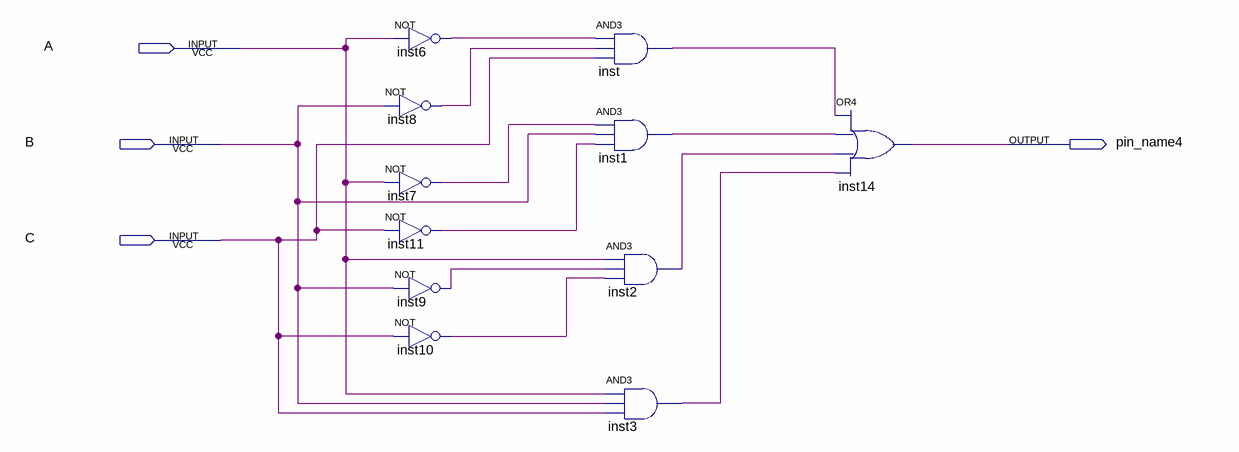
[diagram p0: schematic sheet]
// Quartus schematic Task1A.bdf as structural Verilog: 11 symbols, 4 pins
module Task1A (
  input  A,
  input  B,
  input  C,
  output pin_name4
);

  wire inst1_out, inst2_out, inst3_out, inst6_out, inst7_out, inst8_out, inst9_out, inst10_out, inst11_out,
       inst_out;

  not inst6 (inst6_out, A);
  not inst8 (inst8_out, B);
  not inst7 (inst7_out, A);
  not inst11 (inst11_out, C);
  not inst9 (inst9_out, B);
  not inst10 (inst10_out, C);
  and inst (inst_out, inst6_out, inst8_out, C);
  and inst1 (inst1_out, inst7_out, B, inst11_out);
  and inst2 (inst2_out, A, inst9_out, inst10_out);
  and inst3 (inst3_out, A, B, C);
  or inst14 (pin_name4, inst_out, inst1_out, inst2_out, inst3_out);
endmodule
